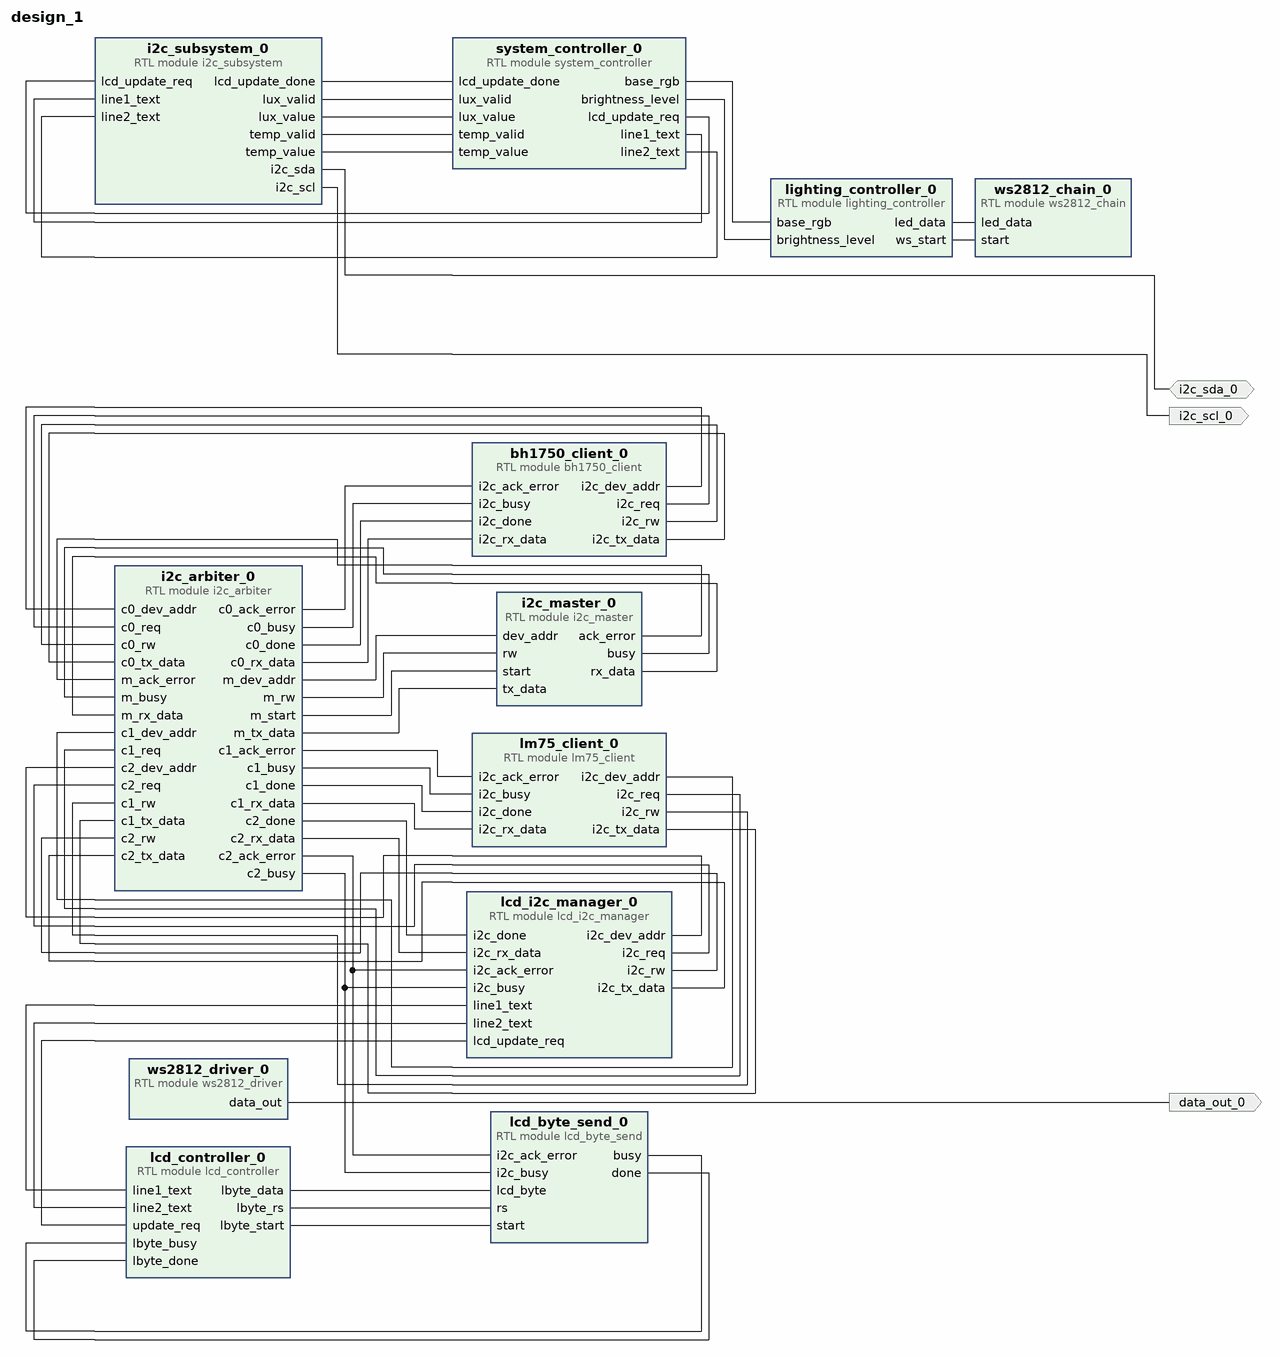
[diagram p0: block diagram of the top level]
# Vivado block design design_1, xc7z020clg400-1, Vivado 2025.1
create_bd_design design_1

create_bd_port -dir IO i2c_sda_0
create_bd_port -dir O i2c_scl_0
create_bd_port -dir O data_out_0

create_bd_cell -type module -reference lighting_controller lighting_controller_0
create_bd_cell -type module -reference ws2812_chain ws2812_chain_0
create_bd_cell -type module -reference system_controller system_controller_0
create_bd_cell -type module -reference i2c_subsystem i2c_subsystem_0
create_bd_cell -type module -reference i2c_master i2c_master_0
create_bd_cell -type module -reference bh1750_client bh1750_client_0
create_bd_cell -type module -reference lm75_client lm75_client_0
create_bd_cell -type module -reference lcd_i2c_manager lcd_i2c_manager_0
create_bd_cell -type module -reference i2c_arbiter i2c_arbiter_0
create_bd_cell -type module -reference ws2812_driver ws2812_driver_0
create_bd_cell -type module -reference lcd_byte_send lcd_byte_send_0
create_bd_cell -type module -reference lcd_controller lcd_controller_0

# ---- connections ----

connect_bd_net [get_bd_ports i2c_sda_0] [get_bd_pins i2c_subsystem_0/i2c_sda]
connect_bd_net [get_bd_pins lcd_i2c_manager_0/line1_text] [get_bd_pins lcd_controller_0/line1_text]
connect_bd_net [get_bd_pins lcd_i2c_manager_0/line2_text] [get_bd_pins lcd_controller_0/line2_text]
connect_bd_net [get_bd_pins lcd_i2c_manager_0/lcd_update_req] [get_bd_pins lcd_controller_0/update_req]
connect_bd_net [get_bd_pins bh1750_client_0/i2c_dev_addr] [get_bd_pins i2c_arbiter_0/c0_dev_addr]
connect_bd_net [get_bd_pins bh1750_client_0/i2c_req] [get_bd_pins i2c_arbiter_0/c0_req]
connect_bd_net [get_bd_pins bh1750_client_0/i2c_rw] [get_bd_pins i2c_arbiter_0/c0_rw]
connect_bd_net [get_bd_pins bh1750_client_0/i2c_tx_data] [get_bd_pins i2c_arbiter_0/c0_tx_data]
connect_bd_net [get_bd_pins i2c_arbiter_0/c0_ack_error] [get_bd_pins bh1750_client_0/i2c_ack_error]
connect_bd_net [get_bd_pins i2c_arbiter_0/c0_busy] [get_bd_pins bh1750_client_0/i2c_busy]
connect_bd_net [get_bd_pins i2c_arbiter_0/c0_done] [get_bd_pins bh1750_client_0/i2c_done]
connect_bd_net [get_bd_pins i2c_arbiter_0/c0_rx_data] [get_bd_pins bh1750_client_0/i2c_rx_data]
connect_bd_net [get_bd_pins i2c_arbiter_0/c1_ack_error] [get_bd_pins lm75_client_0/i2c_ack_error]
connect_bd_net [get_bd_pins i2c_arbiter_0/c1_busy] [get_bd_pins lm75_client_0/i2c_busy]
connect_bd_net [get_bd_pins i2c_arbiter_0/c1_done] [get_bd_pins lm75_client_0/i2c_done]
connect_bd_net [get_bd_pins i2c_arbiter_0/c1_rx_data] [get_bd_pins lm75_client_0/i2c_rx_data]
connect_bd_net [get_bd_pins i2c_arbiter_0/c2_ack_error] [get_bd_pins lcd_i2c_manager_0/i2c_ack_error] [get_bd_pins lcd_byte_send_0/i2c_ack_error]
connect_bd_net [get_bd_pins i2c_arbiter_0/c2_busy] [get_bd_pins lcd_i2c_manager_0/i2c_busy] [get_bd_pins lcd_byte_send_0/i2c_busy]
connect_bd_net [get_bd_pins i2c_arbiter_0/c2_done] [get_bd_pins lcd_i2c_manager_0/i2c_done]
connect_bd_net [get_bd_pins i2c_arbiter_0/c2_rx_data] [get_bd_pins lcd_i2c_manager_0/i2c_rx_data]
connect_bd_net [get_bd_pins i2c_arbiter_0/m_dev_addr] [get_bd_pins i2c_master_0/dev_addr]
connect_bd_net [get_bd_pins i2c_arbiter_0/m_rw] [get_bd_pins i2c_master_0/rw]
connect_bd_net [get_bd_pins i2c_arbiter_0/m_start] [get_bd_pins i2c_master_0/start]
connect_bd_net [get_bd_pins i2c_arbiter_0/m_tx_data] [get_bd_pins i2c_master_0/tx_data]
connect_bd_net [get_bd_pins i2c_master_0/ack_error] [get_bd_pins i2c_arbiter_0/m_ack_error]
connect_bd_net [get_bd_pins i2c_master_0/busy] [get_bd_pins i2c_arbiter_0/m_busy]
connect_bd_net [get_bd_pins i2c_master_0/rx_data] [get_bd_pins i2c_arbiter_0/m_rx_data]
connect_bd_net [get_bd_pins i2c_subsystem_0/i2c_scl] [get_bd_ports i2c_scl_0]
connect_bd_net [get_bd_pins i2c_subsystem_0/lcd_update_done] [get_bd_pins system_controller_0/lcd_update_done]
connect_bd_net [get_bd_pins i2c_subsystem_0/lux_valid] [get_bd_pins system_controller_0/lux_valid]
connect_bd_net [get_bd_pins i2c_subsystem_0/lux_value] [get_bd_pins system_controller_0/lux_value]
connect_bd_net [get_bd_pins i2c_subsystem_0/temp_valid] [get_bd_pins system_controller_0/temp_valid]
connect_bd_net [get_bd_pins i2c_subsystem_0/temp_value] [get_bd_pins system_controller_0/temp_value]
connect_bd_net [get_bd_pins lcd_byte_send_0/busy] [get_bd_pins lcd_controller_0/lbyte_busy]
connect_bd_net [get_bd_pins lcd_byte_send_0/done] [get_bd_pins lcd_controller_0/lbyte_done]
connect_bd_net [get_bd_pins lcd_controller_0/lbyte_data] [get_bd_pins lcd_byte_send_0/lcd_byte]
connect_bd_net [get_bd_pins lcd_controller_0/lbyte_rs] [get_bd_pins lcd_byte_send_0/rs]
connect_bd_net [get_bd_pins lcd_controller_0/lbyte_start] [get_bd_pins lcd_byte_send_0/start]
connect_bd_net [get_bd_pins lcd_i2c_manager_0/i2c_dev_addr] [get_bd_pins i2c_arbiter_0/c2_dev_addr]
connect_bd_net [get_bd_pins lcd_i2c_manager_0/i2c_req] [get_bd_pins i2c_arbiter_0/c2_req]
connect_bd_net [get_bd_pins lcd_i2c_manager_0/i2c_rw] [get_bd_pins i2c_arbiter_0/c2_rw]
connect_bd_net [get_bd_pins lcd_i2c_manager_0/i2c_tx_data] [get_bd_pins i2c_arbiter_0/c2_tx_data]
connect_bd_net [get_bd_pins lighting_controller_0/led_data] [get_bd_pins ws2812_chain_0/led_data]
connect_bd_net [get_bd_pins lighting_controller_0/ws_start] [get_bd_pins ws2812_chain_0/start]
connect_bd_net [get_bd_pins lm75_client_0/i2c_dev_addr] [get_bd_pins i2c_arbiter_0/c1_dev_addr]
connect_bd_net [get_bd_pins lm75_client_0/i2c_req] [get_bd_pins i2c_arbiter_0/c1_req]
connect_bd_net [get_bd_pins lm75_client_0/i2c_rw] [get_bd_pins i2c_arbiter_0/c1_rw]
connect_bd_net [get_bd_pins lm75_client_0/i2c_tx_data] [get_bd_pins i2c_arbiter_0/c1_tx_data]
connect_bd_net [get_bd_pins system_controller_0/base_rgb] [get_bd_pins lighting_controller_0/base_rgb]
connect_bd_net [get_bd_pins system_controller_0/brightness_level] [get_bd_pins lighting_controller_0/brightness_level]
connect_bd_net [get_bd_pins system_controller_0/lcd_update_req] [get_bd_pins i2c_subsystem_0/lcd_update_req]
connect_bd_net [get_bd_pins system_controller_0/line1_text] [get_bd_pins i2c_subsystem_0/line1_text]
connect_bd_net [get_bd_pins system_controller_0/line2_text] [get_bd_pins i2c_subsystem_0/line2_text]
connect_bd_net [get_bd_pins ws2812_driver_0/data_out] [get_bd_ports data_out_0]

validate_bd_design
save_bd_design
